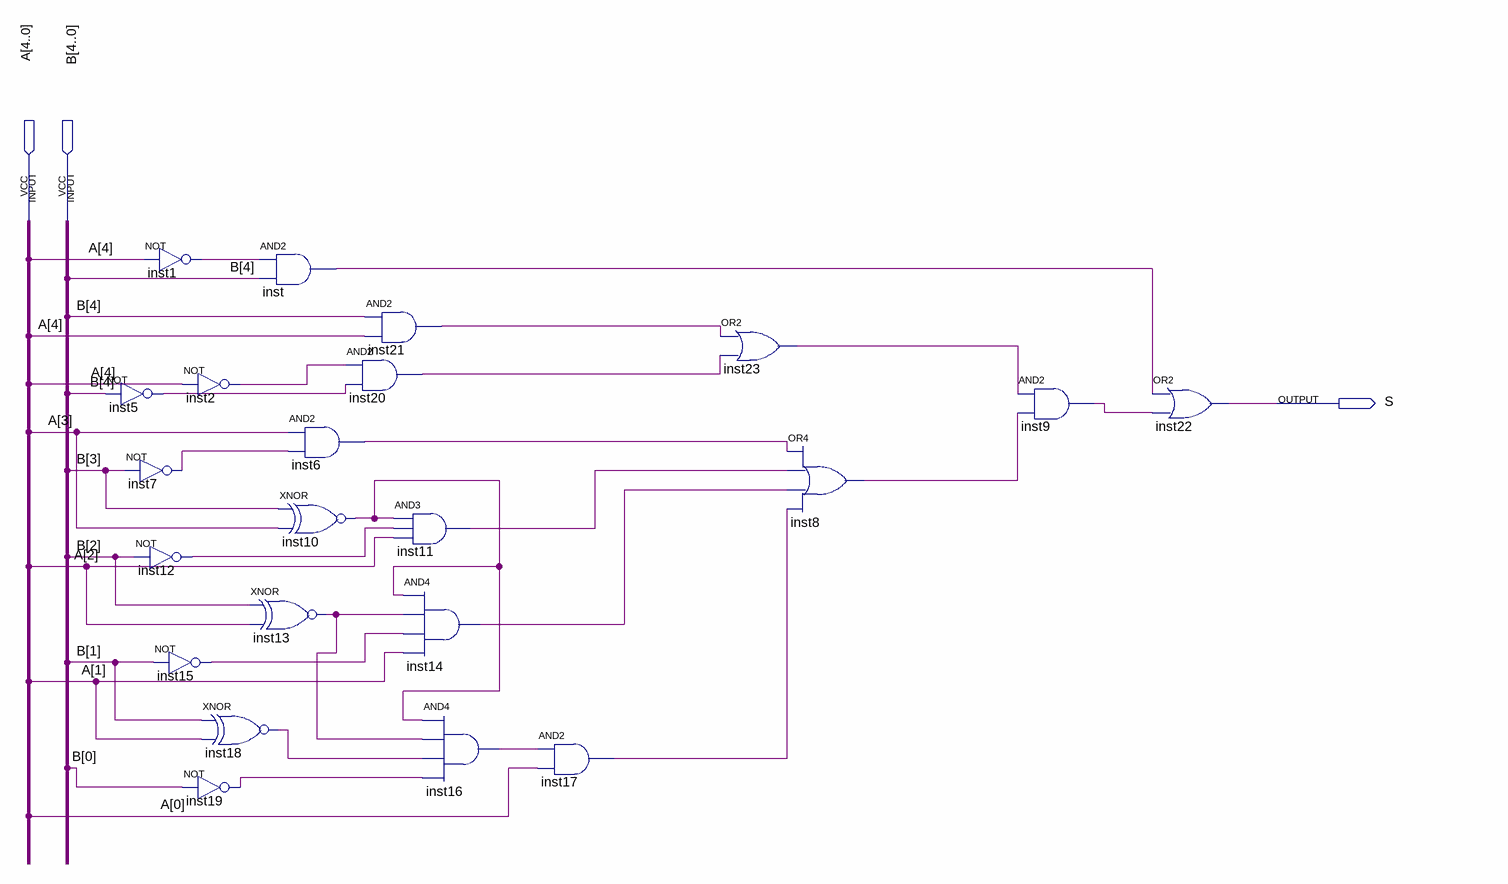
[diagram p0: schematic sheet]
// Quartus schematic comparadores(maior que).bdf as structural Verilog: 22 symbols, 3 pins
module \comparadores(maior_que)  (
  input  [4:0] A,
  input  [4:0] B,
  output S
);

  wire inst1_out, inst2_out, inst5_out, inst6_out, inst7_out, inst8_out, inst9_out, inst10_out, inst11_out,
       inst12_out, inst13_out, inst14_out, inst15_out, inst16_out, inst17_out, inst18_out, inst19_out,
       inst20_out, inst21_out, inst23_out, inst_out;

  not inst5 (inst5_out, B[4]);
  not inst1 (inst1_out, A[4]);
  not inst2 (inst2_out, A[4]);
  not inst7 (inst7_out, B[3]);
  not inst12 (inst12_out, B[2]);
  not inst15 (inst15_out, B[1]);
  not inst19 (inst19_out, B[0]);
  and inst (inst_out, inst1_out, B[4]);
  xnor inst13 (inst13_out, B[2], A[2]);
  xnor inst18 (inst18_out, B[1], A[1]);
  and inst6 (inst6_out, A[3], inst7_out);
  xnor inst10 (inst10_out, B[3], A[3]);
  and inst21 (inst21_out, B[4], A[4]);
  and inst20 (inst20_out, inst2_out, inst5_out);
  and inst11 (inst11_out, inst10_out, inst12_out, A[2]);
  and inst14 (inst14_out, inst10_out, inst13_out, inst15_out, A[1]);
  and inst16 (inst16_out, inst10_out, inst13_out, inst18_out, inst19_out);
  and inst17 (inst17_out, inst16_out, A[0]);
  or inst23 (inst23_out, inst21_out, inst20_out);
  or inst8 (inst8_out, inst6_out, inst11_out, inst14_out, inst17_out);
  and inst9 (inst9_out, inst23_out, inst8_out);
  or inst22 (S, inst_out, inst9_out);
endmodule
